# Altium project T1_Card.PrjPcb (part 3 of 6)

## Sheet INA180.SchDoc
size 431 x 279 mm; Date: Not shown in title block; ApprovedBy: Not shown in title block; CheckedBy: Not shown in title block; Author: Not shown in title block; CompanyName: Not shown in title block; DrawnBy: Andy Lin (TI); Engineer: Not shown in title block; Organization: Not shown in title block; Address1: Not shown in title block; Address2: Not shown in title block; Address3: Not shown in title block; Address4: Not shown in title block; DocumentNumber: 10; Revision: Use project parameter SCH_Rev; SheetNumber: 10; SheetTotal: 14; PageSetup: Record=PageOptions|CenterHorizontal=True|CenterVertical=True|PrintScale=1.00|XCorrection=1.00|YCorrection=1.00|PrintKind=0|BorderSize=5000000|LeftOffset=0|BottomOffset=0|Orientation=2|PaperLength=1000|PaperWidth=1000|Scale=100|PaperSource=15|PrintQuality=600|MediaType=1|DitherType=10|PaperKind=Letter|PrintScaleMode=1; CurrentTime: Not shown in title block; CurrentDate: Not shown in title block; Time: Not shown in title block; DocumentFullPathAndName: Not shown in title block; DocumentName: Not shown in title block; ModifiedDate: Not shown in title block; ImagePath: Not shown in title block
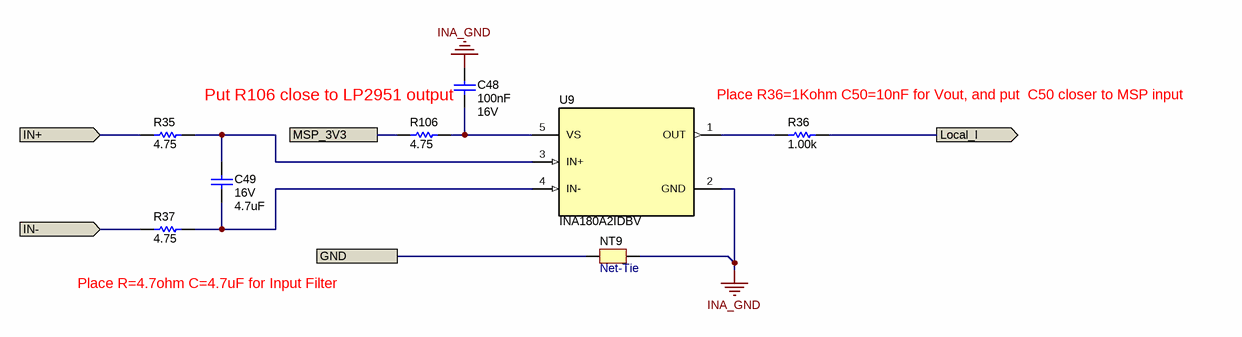
[diagram p6: INA180.SchDoc]

### Parts
C48  Cap_F: 100nF  VDC_V: 16V  [0603]  (hidden comment: GCM188R71C104KA37J)
C49  VDC_V: 16V  ValueDisplayed: 4.7uF  [0402]  (hidden comment: GRM155R61C475ME15)
NT9  Net-Tie  [NetTie_0402]  (net tie, no BOM)
R35  ValueDisplayed: 4.75  [0402]  (hidden comment: CRCW04024R75FKED)
R36  ValueDisplayed: 1.00k  [0402]  (hidden comment: CRCW04021K00FKED)
R37  ValueDisplayed: 4.75  [0402]  (hidden comment: CRCW04024R75FKED)
R106  ValueDisplayed: 4.75  [0402]  (hidden comment: CRCW04024R75FKED)
U9  INA180A2IDBV  [DBV0005A_N]

### Ports
GND, IN+ (in), IN- (in), Local_I (out), MSP_3V3

### Nets
ILIM_GND: NT9.1 ; port GND
INA_GND: C48.2 NT9.2 U9.2(GND)
IN+: R35.1 ; port IN+
IN-: R37.1 ; port IN-
Local_I: R36.2 ; port Local_I
MSP_3V3: R106.1 ; port MSP_3V3
NetC48_1: C48.1 R106.2 U9.5(VS)
NetC49_1: C49.1 R35.2 U9.3(IN+)
NetC49_2: C49.2 R37.2 U9.4(IN-)
NetR36_1: R36.1 U9.1(OUT)

### Notes on the sheet
- (near C48) Put R106 close to LP2951 output
- Place R36=1Kohm C50=10nF for Vout, and put  C50 closer to MSP input
- (near R37) Place R=4.7ohm C=4.7uF for Input Filter
- Drawn By:
- SVN Rev:
- Number:
- TID #:
- Orderable:
- Rev:
- Sheet Title:
- File:
- Project Title:
- Designed for:
- Assembly Variant:
- Mod. Date:
- Sheet:
- Size:
- of
- B
- http://www.ti.com
- Texas Instruments and/or its licensors do not warrant the accuracy or completeness of this specification or any information contained therein. Texas Instruments and/or its licensors do not warrant that this design will meet the specifications, will be suitable for your application or fit for any particular purpose, or will operate in an implementation. Texas Instruments and/or its licensors do not warrant that the design is production worthy. You should completely validate and test your design implementation to confirm the system functionality for your application.
- Engineer:
- Contact:
- © Texas Instruments

### Library data of the parts
C48 = CMP-0007135-4: CAP, CERM, 0.1 uF, 16 V, +/- 10%, X7R, AEC-Q200 Grade 1, 0603; Manufacturer: MuRata; TaMin_C: -55°C; Polarized: N; SizeAreaWB_mm2: 4.68; Value1: Unknown; U/M: EA; Value: 0.1uF; TaMax_C: 125°C; SizeZ_mm: 1; SizeX_mm: 1.6; SizeY_mm: 0.8; SizeArea_mm2: 1.28; AEC Qualified: Y; AEC Category: Q200; Supplier Part Number 2: 81-GCM188R71C104KA7J; Publisher: Texas Instruments; Supplier 2: Mouser; TempCo: X7R; Published: 2008-06-19; RoHS: Y; MountType: SMT; Supplier 1: Digi-Key; PackageReference: 0603; Tolerance_%: 10%; Cap_Case: 0603; Value2: 16V; CompType: Capacitor; LatestRevisionDate: 2017-03-09; PartNumber: GCM188R71C104KA37J; ComponentLink1Description: Datasheet link; AEC Grade: 1; Supplier Part Number 1: 490-8015-1-ND; Technology: Ceramic; ValueDisplayed: 0.1uF; ComponentLink1URL: http://search.murata.co.jp/Ceramy/image/img/w_hinm/S0717E.pdf
C49 = CMP-0006602-2: CAP, CERM, 4.7 uF, 16 V, +/- 20%, X5R, 0402; Manufacturer: MuRata; TaMin_C: -55°C; Polarized: N; SizeAreaWB_mm2: 3; Value1: Unknown; U/M: EA; Value: 4.7uF; TaMax_C: 85°C; SizeZ_mm: 0.6; SizeX_mm: 1; SizeY_mm: 0.5; Cap_F: 4.7µF; AEC Category: Q200; Publisher: Texas Instruments; TempCo: X5R; Published: 2008-06-19; RoHS: Y; MountType: SMT; PackageReference: 0402; Tolerance_%: 20%; Cap_Case: 0402; Value2: 16V; SizeArea_mm2: 0.5; CompType: Capacitor; LatestRevisionDate: 2017-03-09; PartNumber: GRM155R61C475ME15; AEC Qualified: ?; ComponentLink1Description: Datasheet link; Technology: Ceramic; ComponentLink1URL: https://sps06.itg.ti.com/sites/KMS/crossdivteams/altium/docs/ComponentDatasheets/CIN_GRM155R61C475ME15 Electrical Characteristics Data.pdf
NT9 = CMP-0078142-2: Single point connection between nets.; CompType: Net-Tie; PackageReference: N/A; Library Reference: Net-Tie; Manufacturer: N/A; PartNumber: N/A; MountType: SMT
R35 R37 R106 = CMP-0026432-2: RES, 4.75, 1%, 0.063 W, AEC-Q200 Grade 0, 0402; Manufacturer: Vishay-Dale; Power_W: 63mW; TempCo: 100 ppm/C; Value_Code: 4R75; Value: 4.75; EIA_Code: E96; SizeX_mm: 1; SizeY_mm: 0.5; SizeZ_mm: 0.6; Value2: 0.063W; AEC Qualified: Y; VDC_V: 50V; AEC Category: Q200; AEC Grade: 0; ComponentLink1URL: http://www.vishay.com/docs/20035/dcrcwe3.pdf; Supplier Part Number 2: 71-CRCW0402-4.75-E3; Supplier 2: Mouser; RoHS: E; Value1: 1%; MountType: SMT; Supplier 1: Digi-Key; PackageReference: 0402; Tolerance_%: 1%; Res_ohm: 4.75; SizeArea_mm2: 0.5; CompType: Resistor; PartNumber: CRCW04024R75FKED; ComponentLink1Description: Datasheet link; Supplier Part Number 1: 541-4.75LLCT-ND; Technology: Thick Film
R36 = CMP-0026071-3: RES, 1.00 k, 1%, 0.063 W, AEC-Q200 Grade 0, 0402; Manufacturer: Vishay-Dale; Power_W: 63mW; TempCo: 100 ppm/C; Value_Code: 1k00; Value: 1.00k; EIA_Code: E96; Res_ohm: 1k; SizeX_mm: 1; SizeY_mm: 0.5; SizeZ_mm: 0.6; Value2: 0.063W; AEC Qualified: Y; VDC_V: 50V; AEC Category: Q200; AEC Grade: 0; Supplier Part Number 2: 52K6545; Supplier 2: Newark; Supplier Part Number 3: 71-CRCW0402-1.0K-E3; Supplier 3: Mouser; RoHS: E; Value1: 1%; MountType: SMT; Supplier 1: Digi-Key; PackageReference: 0402; Tolerance_%: 1%; SizeArea_mm2: 0.5; CompType: Resistor; PartNumber: CRCW04021K00FKED; ComponentLink1Description: Datasheet link; Supplier Part Number 1: 541-1.00KLCT-ND; Technology: Thick Film; ComponentLink1URL: http://www.vishay.com/docs/20035/dcrcwe3.pdf
U9 = CMP-0013064-2: Low- and High-Side Measurement, Multichannel, Voltage Output, Current-Sense Amplifier, DBV0005A (SOT-5); Manufacturer: Texas Instruments; SizeX_mm: 2.8; SizeY_mm: 2.9; CompType: IC; SizeZ_mm: 1.45; SizeArea_mm2: 8.12; SizeAreaWB_mm2: 14.82; U/M: EA; PackageDescription: SOT-5; PartNumber: INA180A2IDBV; ComponentLink1URL: https://sps06.itg.ti.com/sites/KMS/crossdivteams/altium/docs/ComponentDatasheets/INA180.pdf; ComponentLink1Description: Datasheet Link; LatestRevisionDate: 2017-03-09; Publisher: Texas Instruments; PackageReference: DBV0005A; MountType: SMT; Alternate Manufacturer: Texas Instruments